# EAGLE design regulator_adj_1_5A (EAGLE 5.08)
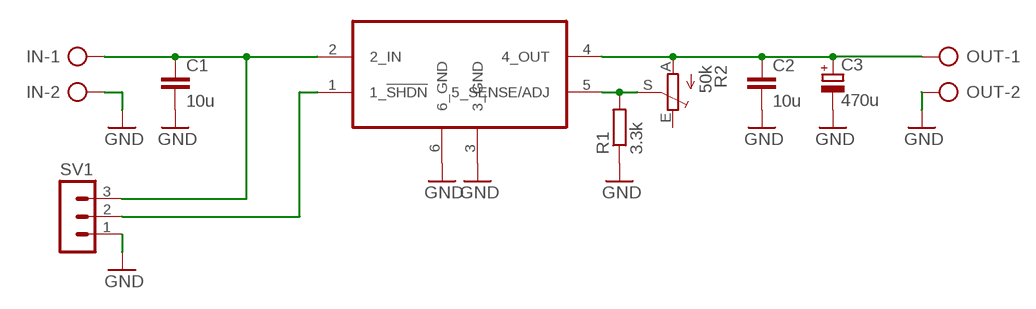
[diagram p0: schematic, sheet 1]

## Parts
C1  10u  C-EUC1206  [C1206]
C2  10u  C-EUC1206  [C1206]
C3  470u  CPOL-EUE5-10.5  [E5-10,5]
IN  AK300/2  [AK300/2]
OUT  AK300/2  [AK300/2]
R1  3.3k  R-EU_R1206  [R1206]
R2  50k  TRIM_EU-B25P  [B25P]
SV1  MA03-1  [MA03-1]
U$1  TPS7A45XX  [SOT223-5]

## Nets
GND: C1.2 C2.2 C3.- IN.2 OUT.2 R1.1 SV1.1 U$1.3(3_GND) U$1.6(6_GND)
N$1: C1.1 IN.1 SV1.3 U$1.2(2_IN)
N$2: C2.1 C3.+ OUT.1 R2.A U$1.4(4_OUT)
N$3: R1.2 R2.S U$1.5(5_SENSE/ADJ)
N$4: SV1.2 U$1.1(1_!SHDN)
Unconnected: R2.E

## Library data of the parts
C1 C2 = resistor:C-EU: CAPACITOR, European symbol
C3 = resistor:CPOL-EU: POLARIZED CAPACITOR, European symbol
IN OUT = con-ptr500:AK300/2: CONNECTOR
R1 = resistor:R-EU_: RESISTOR, European symbol
R2 = pot:TRIM_EU-: POTENTIOMETER
SV1 = con-lstb:MA03-1: PIN HEADER
U$1 = TPS7A45xx:TPS7A45XX

## Board
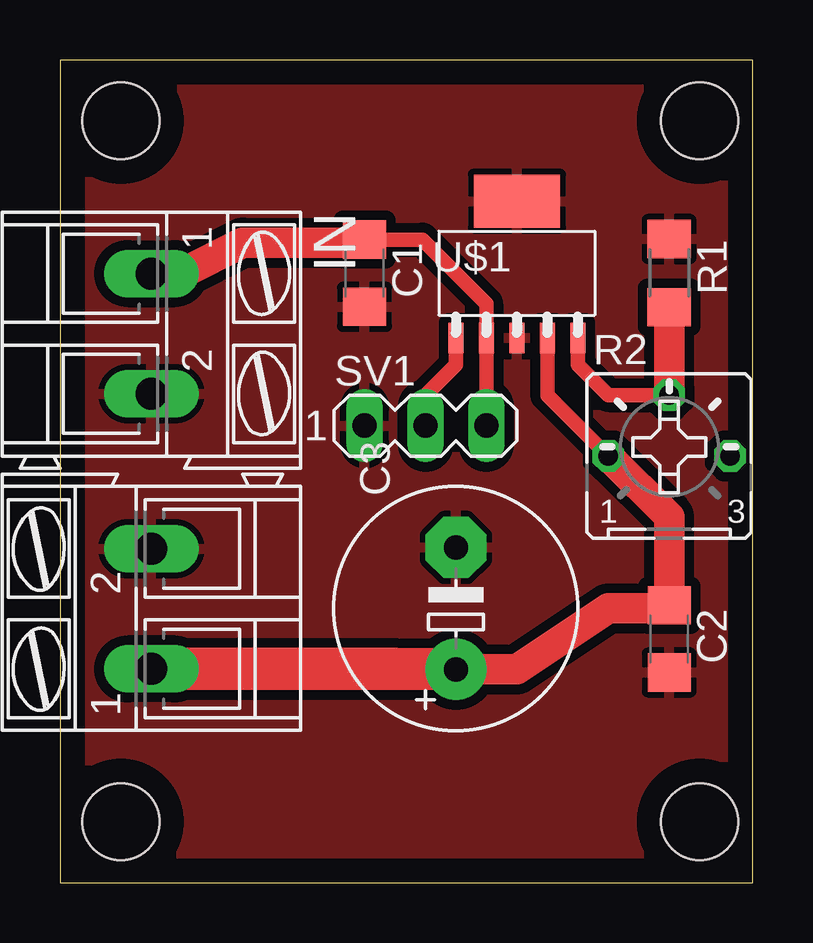
[diagram p1: board, top side]
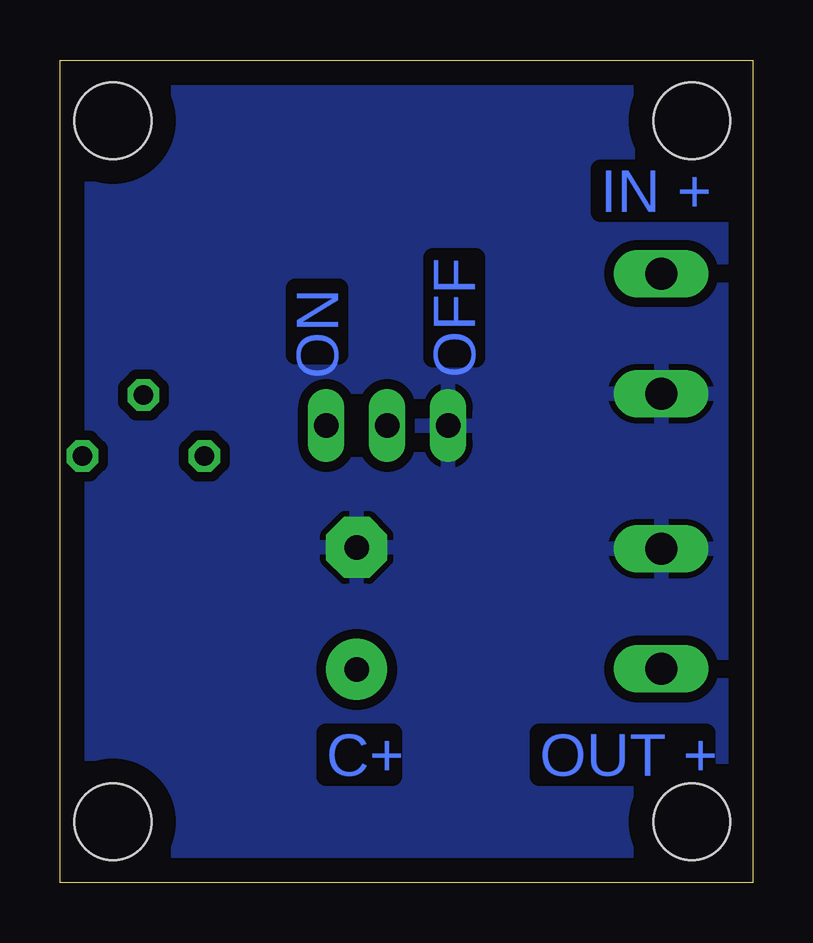
[diagram p2: board, bottom side, seen from below]

Size 28.88 x 34.28 mm. Coordinates in mm from the lower left corner, seen from the top.
Outline: 0,0 28.88,0 28.88,34.28 0,34.28 0,0
Copper layers (1*16): Top 0.035mm / dielectric 1.5mm / Bottom 0.035mm
Design rules "default *": minimum track width 10mil, minimum drill 0.6mm, track to track 16mil, track to pad 16mil, pad to pad 16mil, via to via 16mil, smd to smd 16mil, copper to edge 40mil, drill to drill 8mil, minimum pad ring 10mil, minimum via ring 8mil, stop-mask expansion 4mil, vias tented up to drill 0mil, thermal gap 10mil
Holes 3.2 mm at 2.54,31.75 26.67,31.75 26.67,2.54 2.54,2.54

### Footprints (pad centres in the part's own frame; a part is rotated, then mirrored left to right if it is on the bottom)
C1206 = smd 1.6 x 1.8: 1 -1.4,0; 2 1.4,0
E5-10,5 = drill 1.016 pad 2.54 round: + -2.54,0 | drill 1.016 pad 2.54 octagon: - 2.54,0
AK300/2 = drill 1.321 long: 1 -2.515,0; 2 2.489,0
R1206 = smd 1.6 x 1.803: 1 -1.422,0; 2 1.422,0
B25P = drill 0.813 octagon: A -2.54,0; E 2.54,0; S 0,2.54
MA03-1 = drill 1.016 long: 1 -2.54,0; 2 0,0; 3 2.54,0
SOT223-5 = smd 0.635 x 1.27: 1 -2.54,-2.7; 2 -1.27,-2.7; 3 0,-2.7; 4 1.27,-2.7; 5 2.54,-2.7 | smd 3.6 x 2.2: 6 0,3

### Placement (x,y rotation side)
C1  12.7,25.4 270 top
C2  25.4,10.16 270 top
C3  16.51,11.43 90 top
IN  3.81,22.86 270 top
OUT  3.81,11.43 90 top
R1  25.4,25.4 270 top
R2  25.4,17.78 0 top
SV1  15.24,19.05 0 top
U$1  19.05,25.4 0 top

### Tracks (layer width: path | path; a pad name or v marks a point on that pad's centre or on a via)
GND
  pour Top: 0,34.29 29.21,34.29 29.21,0 0,0
  pour Bottom: 0,34.29 29.21,34.29 29.21,0 0,0
N$1
  Top 0.61: C1.1 15.11,26.8 17.78,24.13 U$1.2 SV1.3
  Top 1.27: IN.1 5.05,25.38 7.62,26.67 12.7,26.67 C1.1
N$2
  Top 0.61: U$1.4 20.32,20.32 R2.A
  Top 1.27: C3.+ 19.05,8.89 22.86,11.43 25.4,11.43 C2.1 25.4,15.24 R2.A
  Top 1.778: OUT.1 13.95,8.92 C3.+
N$3
  Top 0.61: U$1.5 21.59,21.59 22.86,20.32 R2.S
  Top 1.27: R2.S R1.2
N$4
  Top 0.61: SV1.2 15.24,20.32 16.51,21.59 U$1.1

### Text on the board
Bottom: IN + | OFF | ON | OUT + | C+